# EAGLE schematic M050B (EAGLE 6.6.0)
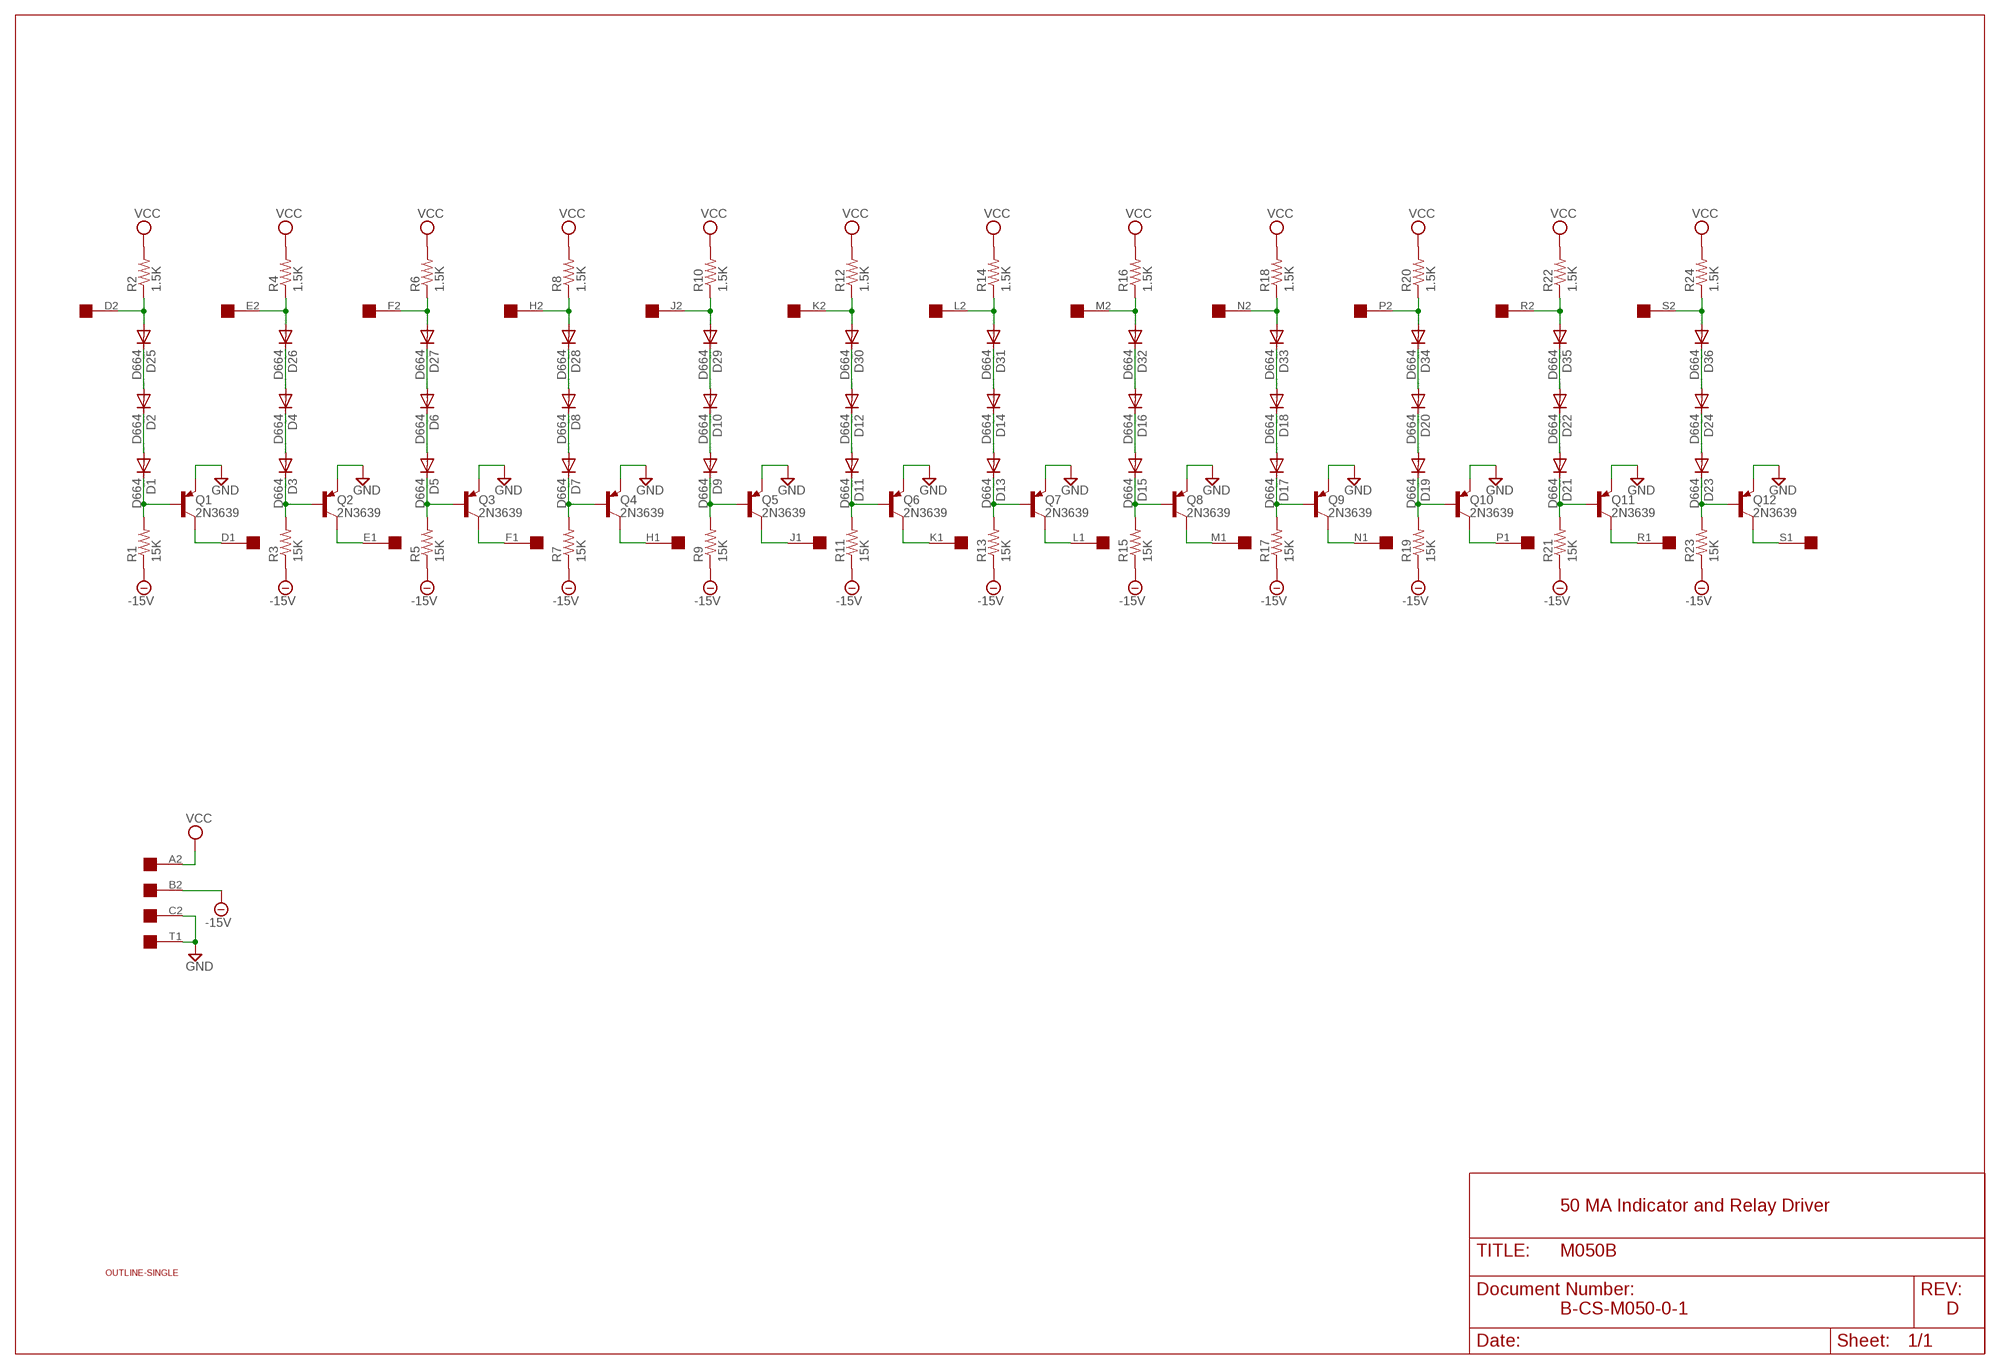
[diagram p0: schematic, sheet 1]

## Parts
D1  D664  DIODE-DO35-10  [DO35-10]
D2  D664  DIODE-DO35-10  [DO35-10]
D3  D664  DIODE-DO35-10  [DO35-10]
D4  D664  DIODE-DO35-10  [DO35-10]
D5  D664  DIODE-DO35-10  [DO35-10]
D6  D664  DIODE-DO35-10  [DO35-10]
D7  D664  DIODE-DO35-10  [DO35-10]
D8  D664  DIODE-DO35-10  [DO35-10]
D9  D664  DIODE-DO35-10  [DO35-10]
D10  D664  DIODE-DO35-10  [DO35-10]
D11  D664  DIODE-DO35-10  [DO35-10]
D12  D664  DIODE-DO35-10  [DO35-10]
D13  D664  DIODE-DO35-10  [DO35-10]
D14  D664  DIODE-DO35-10  [DO35-10]
D15  D664  DIODE-DO35-10  [DO35-10]
D16  D664  DIODE-DO35-10  [DO35-10]
D17  D664  DIODE-DO35-10  [DO35-10]
D18  D664  DIODE-DO35-10  [DO35-10]
D19  D664  DIODE-DO35-10  [DO35-10]
D20  D664  DIODE-DO35-10  [DO35-10]
D21  D664  DIODE-DO35-10  [DO35-10]
D22  D664  DIODE-DO35-10  [DO35-10]
D23  D664  DIODE-DO35-10  [DO35-10]
D24  D664  DIODE-DO35-10  [DO35-10]
D25  D664  DIODE-DO35-10  [DO35-10]
D26  D664  DIODE-DO35-10  [DO35-10]
D27  D664  DIODE-DO35-10  [DO35-10]
D28  D664  DIODE-DO35-10  [DO35-10]
D29  D664  DIODE-DO35-10  [DO35-10]
D30  D664  DIODE-DO35-10  [DO35-10]
D31  D664  DIODE-DO35-10  [DO35-10]
D32  D664  DIODE-DO35-10  [DO35-10]
D33  D664  DIODE-DO35-10  [DO35-10]
D34  D664  DIODE-DO35-10  [DO35-10]
D35  D664  DIODE-DO35-10  [DO35-10]
D36  D664  DIODE-DO35-10  [DO35-10]
Q1  2N3639  -PNP-TO5  [TO5]
Q2  2N3639  -PNP-TO5  [TO5]
Q3  2N3639  -PNP-TO5  [TO5]
Q4  2N3639  -PNP-TO5  [TO5]
Q5  2N3639  -PNP-TO5  [TO5]
Q6  2N3639  -PNP-TO5  [TO5]
Q7  2N3639  -PNP-TO5  [TO5]
Q8  2N3639  -PNP-TO5  [TO5]
Q9  2N3639  -PNP-TO5  [TO5]
Q10  2N3639  -PNP-TO5  [TO5]
Q11  2N3639  -PNP-TO5  [TO5]
Q12  2N3639  -PNP-TO5  [TO5]
R1  15K  R-US_0207/10  [0207/10]
R2  1.5K  R-US_0207/10  [0207/10]
R3  15K  R-US_0207/10  [0207/10]
R4  1.5K  R-US_0207/10  [0207/10]
R5  15K  R-US_0207/10  [0207/10]
R6  1.5K  R-US_0207/10  [0207/10]
R7  15K  R-US_0207/10  [0207/10]
R8  1.5K  R-US_0207/10  [0207/10]
R9  15K  R-US_0207/10  [0207/10]
R10  1.5K  R-US_0207/10  [0207/10]
R11  15K  R-US_0207/10  [0207/10]
R12  1.5K  R-US_0207/10  [0207/10]
R13  15K  R-US_0207/10  [0207/10]
R14  1.5K  R-US_0207/10  [0207/10]
R15  15K  R-US_0207/10  [0207/10]
R16  1.5K  R-US_0207/10  [0207/10]
R17  15K  R-US_0207/10  [0207/10]
R18  1.5K  R-US_0207/10  [0207/10]
R19  15K  R-US_0207/10  [0207/10]
R20  1.5K  R-US_0207/10  [0207/10]
R21  15K  R-US_0207/10  [0207/10]
R22  1.5K  R-US_0207/10  [0207/10]
R23  15K  R-US_0207/10  [0207/10]
R24  1.5K  R-US_0207/10  [0207/10]
U$1  OUTLINE-SINGLE  [SINGLE]
U$2  SINGLE  [EDGE-CON2]

## Nets
-15V [supply]: R1.1 R3.1 R5.1 R7.1 R9.1 R11.1 R13.1 R15.1 R17.1 R19.1 R21.1 R23.1 U$2.B2
D7: D6.A D27.C
GND [supply]: Q1.1(E) Q2.1(E) Q3.1(E) Q4.1(E) Q5.1(E) Q6.1(E) Q7.1(E) Q8.1(E) Q9.1(E) Q10.1(E) Q11.1(E) Q12.1(E) U$2.C2 U$2.T1
N$1: D25.A R2.1 U$2.D2
N$2: D2.A D25.C
N$3: D1.A D2.C
N$4: D1.C Q1.2(B) R1.2
N$5: Q1.3(C) U$2.D1
N$6: D26.A R4.1 U$2.E2
N$7: D4.A D26.C
N$8: D3.A D4.C
N$9: D3.C Q2.2(B) R3.2
N$10: Q2.3(C) U$2.E1
N$11: D27.A R6.1 U$2.F2
N$13: D5.A D6.C
N$14: D5.C Q3.2(B) R5.2
N$15: Q3.3(C) U$2.F1
N$16: D28.A R8.1 U$2.H2
N$17: D8.A D28.C
N$18: D7.A D8.C
N$19: D7.C Q4.2(B) R7.2
N$20: Q4.3(C) U$2.H1
N$21: D29.A R10.1 U$2.J2
N$22: D10.A D29.C
N$23: D9.A D10.C
N$24: D9.C Q5.2(B) R9.2
N$25: Q5.3(C) U$2.J1
N$26: D30.A R12.1 U$2.K2
N$27: D12.A D30.C
N$28: D11.A D12.C
N$29: D11.C Q6.2(B) R11.2
N$30: Q6.3(C) U$2.K1
N$31: D31.A R14.1 U$2.L2
N$32: D14.A D31.C
N$33: D13.A D14.C
N$34: D13.C Q7.2(B) R13.2
N$35: Q7.3(C) U$2.L1
N$36: D32.A R16.1 U$2.M2
N$37: D16.A D32.C
N$38: D15.A D16.C
N$39: D15.C Q8.2(B) R15.2
N$40: Q8.3(C) U$2.M1
N$41: D33.A R18.1 U$2.N2
N$42: D18.A D33.C
N$43: D17.A D18.C
N$44: D17.C Q9.2(B) R17.2
N$45: Q9.3(C) U$2.N1
N$46: D34.A R20.1 U$2.P2
N$47: D20.A D34.C
N$48: D19.A D20.C
N$49: D19.C Q10.2(B) R19.2
N$50: Q10.3(C) U$2.P1
N$51: D35.A R22.1 U$2.R2
N$52: D22.A D35.C
N$53: D21.A D22.C
N$54: D21.C Q11.2(B) R21.2
N$55: Q11.3(C) U$2.R1
N$56: D36.A R24.1 U$2.S2
N$57: D24.A D36.C
N$58: D23.A D24.C
N$59: D23.C Q12.2(B) R23.2
N$60: Q12.3(C) U$2.S1
VCC [supply]: R2.2 R4.2 R6.2 R8.2 R10.2 R12.2 R14.2 R16.2 R18.2 R20.2 R22.2 R24.2 U$2.A2
Unconnected: U$2.A1 U$2.B1 U$2.C1 U$2.T2 U$2.U1 U$2.U2 U$2.V1 U$2.V2

## Notes on the sheet
- 50 MA Indicator and Relay Driver
- B-CS-M050-0-1 | D

## Library data of the parts
D1-D36 = diode:DIODE-: DIODE
Q1-Q12 = transistor:*-PNP-: PNP Transistror
R1-R24 = rcl:R-US_: RESISTOR, American symbol
U$1 = dec-con:OUTLINE-*: Board outlines for DEC boards.
U$2 = dec-con:SINGLE: Single-Height DEC board

## Net classes
1 supply: width 0.813 mm